# EAGLE design flex_breakout (EAGLE 7.5.0)
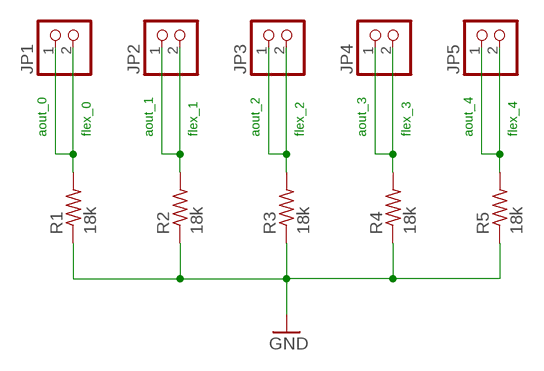
[diagram p0: schematic, sheet 1]

## Parts
JP1  PINHD-1X2  [1X02]
JP2  PINHD-1X2  [1X02]
JP3  PINHD-1X2  [1X02]
JP4  PINHD-1X2  [1X02]
JP5  PINHD-1X2  [1X02]
R1  18k  R-US_0204/7  [0204/7]
R2  18k  R-US_0204/7  [0204/7]
R3  18k  R-US_0204/7  [0204/7]
R4  18k  R-US_0204/7  [0204/7]
R5  18k  R-US_0204/7  [0204/7]

## Nets
GND: R1.1 R2.1 R3.1 R4.1 R5.1
N$1: JP1.1 JP1.2 R1.2
N$2: JP2.1 JP2.2 R2.2
N$3: JP3.1 JP3.2 R3.2
N$4: JP4.1 JP4.2 R4.2
N$5: JP5.1 JP5.2 R5.2

## Notes on the sheet
- aout_0 | flex_0 | aout_1 | flex_1 | aout_2 | flex_2 | aout_3 | flex_3 | aout_4 | flex_4

## Library data of the parts
JP1-JP5 = pinhead:PINHD-1X2: PIN HEADER
R1-R5 = resistor:R-US_: RESISTOR, American symbol

## Net classes
0 default: width 0.508 mm, drill 0.508 mm, clearance 0.254 mm

## Board
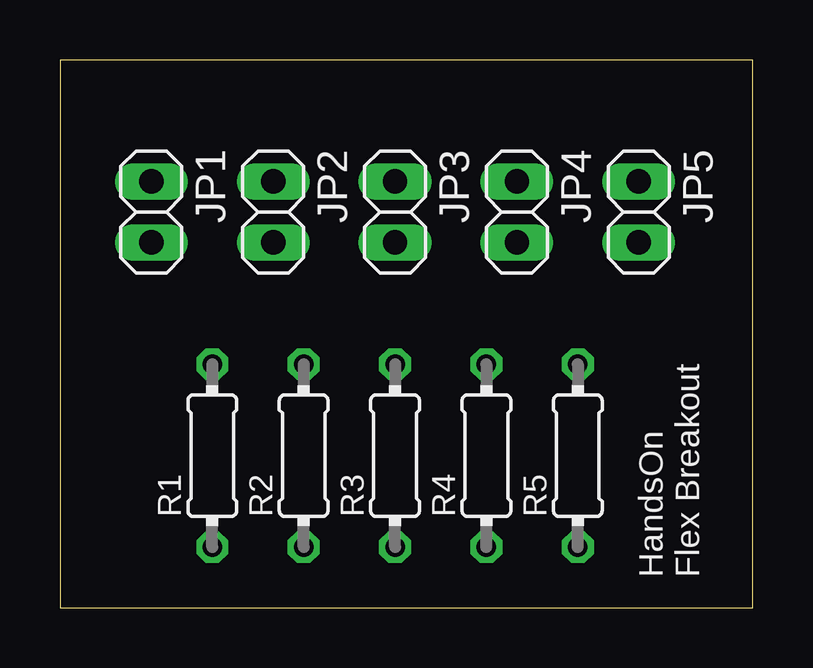
[diagram p1: board, top side]
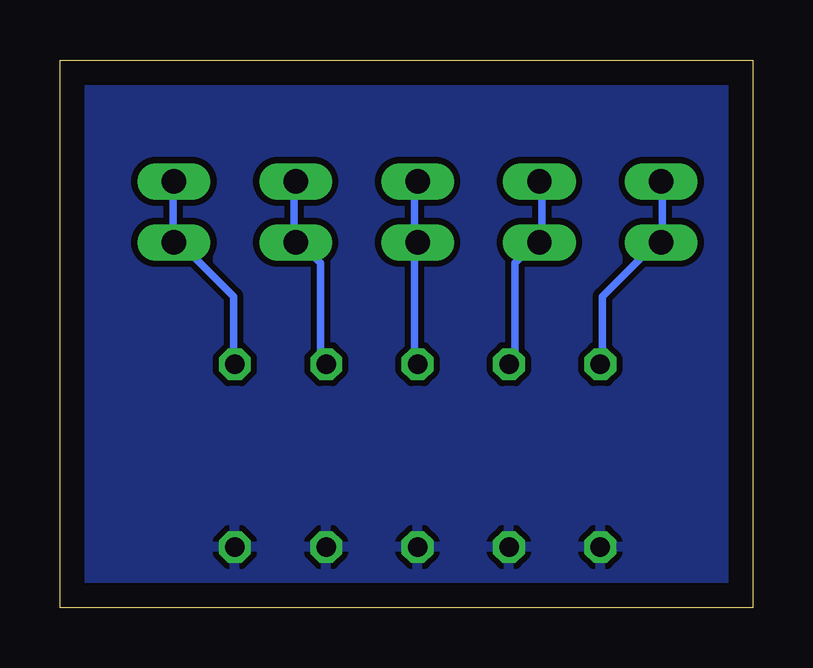
[diagram p2: board, bottom side, seen from below]

Size 28.88 x 22.85 mm. Coordinates in mm from the lower left corner, seen from the top.
Outline: 0,0 28.88,0 28.88,22.85 0,22.85 0,0
Copper layers (1*16): Top 0.035mm / dielectric 1.5mm / Bottom 0.035mm
Design rules "default": minimum track width 10mil, minimum drill 24mil, track to track 8mil, track to pad 8mil, pad to pad 8mil, via to via 8mil, smd to smd 8mil, copper to edge 40mil, drill to drill 8mil, minimum pad ring 10mil, minimum via ring 8mil, stop-mask expansion 4mil, vias tented up to drill 0mil, thermal gap 10mil

### Footprints (pad centres in the part's own frame; a part is rotated, then mirrored left to right if it is on the bottom)
1X02 = drill 1.016 long: 1 -1.27,0; 2 1.27,0
0204/7 = drill 0.813 octagon: 1 -3.81,0; 2 3.81,0

### Placement (x,y rotation side)
JP1  3.81,16.51 270 top
JP2  8.89,16.51 270 top
JP3  13.97,16.51 270 top
JP4  19.05,16.51 270 top
JP5  24.13,16.51 270 top
R1  6.35,6.35 90 top
R2  10.16,6.35 90 top
R3  13.97,6.35 90 top
R4  17.78,6.35 90 top
R5  21.59,6.35 90 top

### Tracks (layer width: path | path; a pad name or v marks a point on that pad's centre or on a via)
GND
  pour Bottom: -2.54,22.86 30.48,22.86 30.48,-2.54 -2.54,-2.54
N$1
  Bottom 0.305: R1.2 6.27,10.19 6.27,12.98 4.04,15.21 JP1.2 3.76,15.49 3.76,17.73 JP1.1
N$2
  Bottom 0.305: R2.2 9.91,10.19 9.91,14.38 9.07,15.21 JP2.2 8.79,15.49 8.79,17.73 JP2.1
N$3
  Bottom 0.305: R3.2 14.1,10.19 14.1,15.21 JP3.2 14.1,15.49 14.1,17.73 JP3.1
N$4
  Bottom 0.305: R4.2 18.01,10.19 18.01,14.38 18.85,15.21 JP4.2 19.13,15.49 19.13,17.73 JP4.1
N$5
  Bottom 0.305: R5.2 21.64,10.19 21.64,12.98 23.88,15.21 JP5.2 24.16,15.49 24.16,17.73 JP5.1

### Text on the board
tPlace: HandsOn / Flex Breakout